# EAGLE design leds-2 (EAGLE 7.7.0)
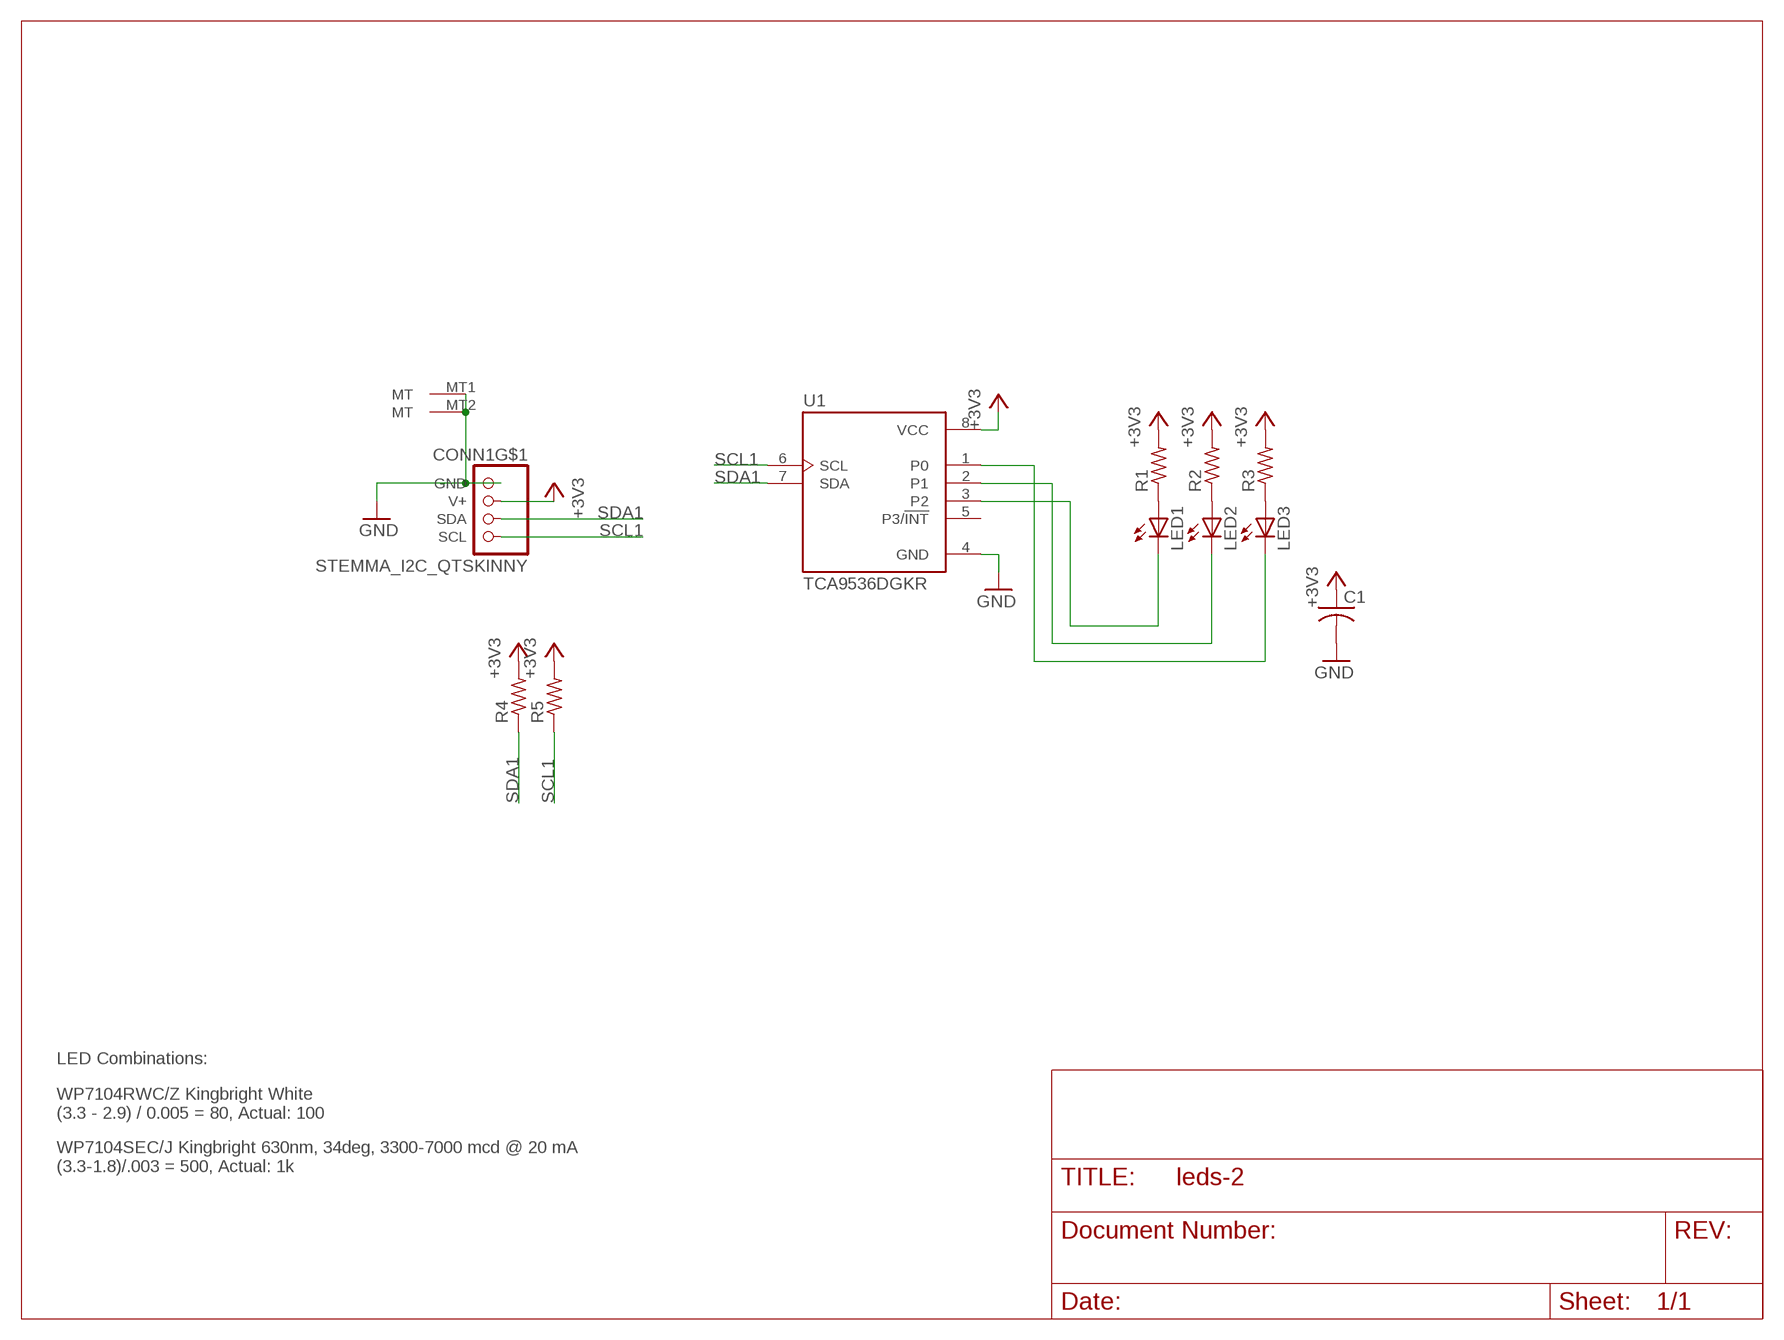
[diagram p0: schematic, sheet 1]

## Parts
C1  C-USC0603K  [C0603K]
CONN1  STEMMA_I2C_QTSKINNY  [JST_SH4_SKINNY]
LED1  LED3MM  [LED3MM]
LED2  LED3MM  [LED3MM]
LED3  LED3MM  [LED3MM]
R1  R-US_R0603  [R0603]
R2  R-US_R0603  [R0603]
R3  R-US_R0603  [R0603]
R4  R-US_R0603  [R0603]
R5  R-US_R0603  [R0603]
U1  TCA9536DGKR  [SOP65P490X110-8N]

## Nets
+3V3: C1.1 CONN1.2(V+) R1.2 R2.2 R3.2 R4.2 R5.2 U1.8(VCC)
GND [power]: C1.2 CONN1.1(GND) CONN1.MT1(MT) CONN1.MT2(MT) U1.4(GND)
N$1: LED3.K(C) U1.1(P0)
N$2: LED2.K(C) U1.2(P1)
N$3: LED1.K(C) U1.3(P2)
N$4: LED1.A R1.1
N$5: LED2.A R2.1
N$6: LED3.A R3.1
SCL1: CONN1.4(SCL) R5.1 U1.6(SCL)
SDA1: CONN1.3(SDA) R4.1 U1.7(SDA)
Unconnected: U1.5(P3/!INT)

## Notes on the sheet
- LED Combinations:
- WP7104RWC/Z Kingbright White
  (3.3 - 2.9) / 0.005 = 80, Actual: 100
- WP7104SEC/J Kingbright 630nm, 34deg, 3300-7000 mcd @ 20 mA
  (3.3-1.8)/.003 = 500, Actual: 1k

## Library data of the parts
C1 = rcl:C-US: CAPACITOR, American symbol
CONN1 = microbuilder:STEMMA_I2C
LED1-LED3 = led:LED: LED OSRAM: - CHIPLED LG R971, LG N971, LY N971, LG Q971, LY Q971, LO R971, LY R971 LH N974, LH R974 LS Q976, LO Q976, LY Q976 LO Q996 - Hyper CHIPLED LW Q18S LB Q993, LB Q99A, LB R99A - SideLED LS A670, LO A670, LY A670, LG A670, LP A670 LB A673, LV A673, LT A673, LW A673 LH A674 LY A675 LS A676, LA A676, LO A676, LY A676, LW A676 LS A679, LY A679, LG A679 - Hyper Micro SIDELED® LS Y876, LA Y876, LO Y876, LY Y876 LT Y87S - SmartLED LW L88C, LW L88S LB L89C, LB L89S, LG L890 LS L89K, LO L89K, LY L89K LS L896, LA L896, LO L896, LY L896 - TOPLED LS T670, LO T670, LY T670, LG T670, LP T670 LSG T670, LSP T670, LSY T670, LOP T670, LYG T670 LG T671, LOG T671, LSG T671 LB T673, LV T673, LT T673, LW T673 LH T674 LS T676, LA T676, LO T676, LY T676, LB T676, LH T676, LSB T676, LW T676 LB T67C, LV T67C, LT T67C, LS T67K, LO T67K, LY T67K, LW E67C LS E67B, LA E67B, LO E67B, LY E67B, LB E67C, LV E67C, LT E67C LW T67C LS T679, LY T679, LG T679 LS T770, LO T770, LY T770, LG T770, LP T770 LB T773, LV T773, LT T773, LW T773 LH T774 LS E675, LA E675, LY E675, LS T675 LS T776, LA T776, LO T776, LY T776, LB T776 LHGB T686 LT T68C, LB T68C - Hyper Mini TOPLED® LB M676 - Mini TOPLED Santana® LG M470 LS M47K, LO M47K, LY M47K Source: http://www.osram.convergy.de LUXEON: - LUMILED® LXK2-PW12-R00, LXK2-PW12-S00, LXK2-PW14-U00, LXK2-PW14-V00 LXK2-PM12-R00, LXK2-PM12-S00, LXK2-PM14-U00 LXK2-PE12-Q00, LXK2-PE12-R00, LXK2-PE12-S00, LXK2-PE14-T00, LXK2-PE14-U00 LXK2-PB12-K00, LXK2-PB12-L00, LXK2-PB12-M00, LXK2-PB14-N00, LXK2-PB14-P00, LXK2-PB14-Q00 LXK2-PR12-L00, LXK2-PR12-M00, LXK2-PR14-Q00, LXK2-PR14-R00 LXK2-PD12-Q00, LXK2-PD12-R00, LXK2-PD12-S00 LXK2-PH12-R00, LXK2-PH12-S00 LXK2-PL12-P00, LXK2-PL12-Q00, LXK2-PL12-R00 Source: www.luxeon.com KINGBRIGHT: KA-3528ASYC Source: www.kingbright.com
R1-R5 = rcl:R-US_: RESISTOR, American symbol
U1 = TCA9536DGKR:TCA9536DGKR; MANUFACTURER: Texas Instruments; MAXIMUM_PACKAGE_HEIGHT: 1.1 mm; PARTREV: A; STANDARD: IPC 7351B

## Net classes
1 power: width 0.305 mm

## Board
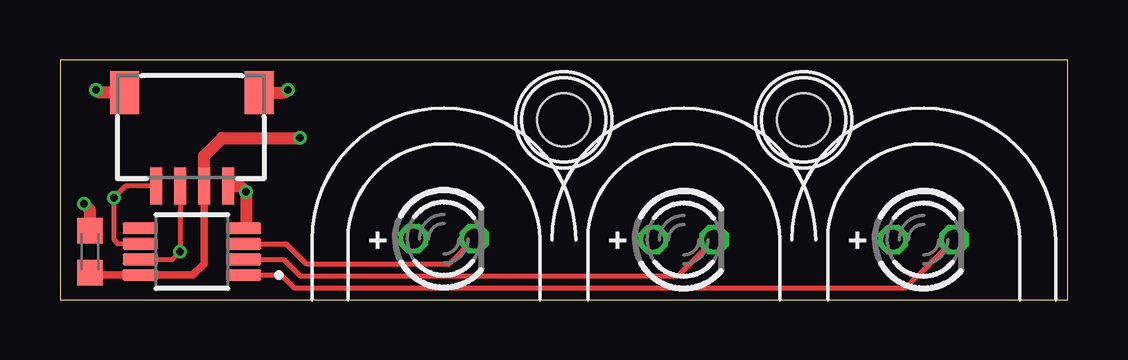
[diagram p1: board, top side]
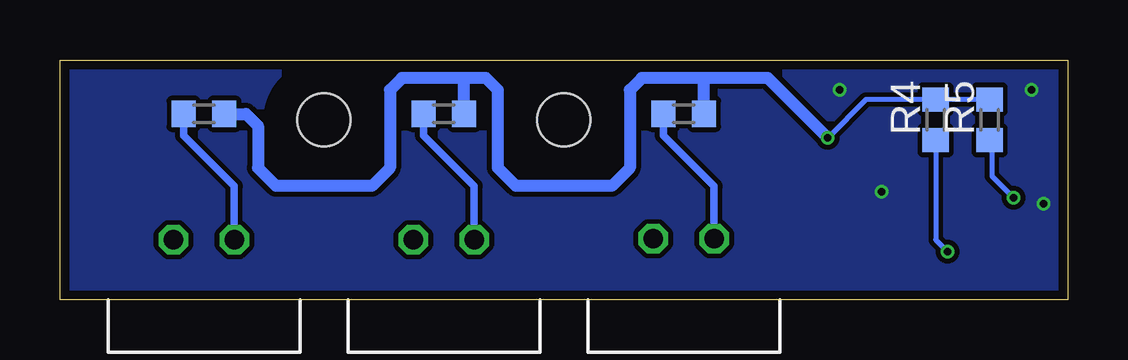
[diagram p2: board, bottom side, seen from below]

Size 42 x 10 mm. Coordinates in mm from the lower left corner, seen from the top.
Outline: 0,0 42,0 42,10 0,10 0,0
Copper layers (1*16): Top 0.035559375mm / dielectric 1.6mm / Bottom 0.035559375mm
Design rules "oshpark-2layer-2018": minimum track width 6mil, minimum drill 10mil, track to track 6mil, track to pad 6mil, pad to pad 6mil, via to via 6mil, smd to smd 6mil, copper to edge 15mil, drill to drill 6mil, minimum pad ring 5mil, minimum via ring 5mil, stop-mask expansion 2.5mil, vias tented up to drill 0mil, thermal gap 10mil
Holes 2.2 mm at 21,7.5 31,7.5
bRestrict: area 18.7,5.2 to 23.3,9.8; area 28.7,5.2 to 33.3,9.8

### Footprints (pad centres in the part's own frame; a part is rotated, then mirrored left to right if it is on the bottom)
C0603K = smd 1.05 x 1.08: 1 -0.875,0; 2 0.875,0
JST_SH4_SKINNY = smd 0.5 x 1.55: 1 -1.5,2.514; 2 -0.5,2.514; 3 0.5,2.514; 4 1.5,2.514 | smd 1.2 x 1.8: MT1 -2.8,-1.386; MT2 2.8,-1.386
LED3MM = drill 0.813 octagon: A -1.27,0; K 1.27,0
R0603 = smd 1 x 1.1: 1 -0.85,0; 2 0.85,0
SOP65P490X110-8N = smd 1.47 x 0.48: 1 -2.15,0.975; 2 -2.15,0.325; 3 -2.15,-0.325; 4 -2.15,-0.975; 5 2.15,-0.975; 6 2.15,-0.325; 7 2.15,0.325; 8 2.15,0.975

### Placement (x,y rotation side)
C1  1.25,2 90 top
CONN1  5.5,7.25 180 top
LED1  16,2.54 0 top
LED2  26,2.5 0 top
LED3  36,2.5 0 top
R1  16,7.75 0 bottom
R2  26,7.75 0 bottom
R3  36,7.75 0 bottom
R4  5.5,7.5 90 bottom
R5  3.25,7.5 90 bottom
U1  5.5,2 180 top

### Tracks (layer width: path | path; a pad name or v marks a point on that pad's centre or on a via)
+3V3  (via drill 0.3)
  Top 0.203: 1.25,1.02 C1.1
  Top 0.305: 1.25,1.02 U1.8 5.53,1.02 6,1.5 CONN1.2
  Top 0.508: CONN1.2 6,6 6.75,6.75 v10,6.75
  Bottom 0.203: 25.15,9.15 25.25,9.25 | 15.15,9.15 15.25,9.25 | R5.2 R4.2 8.4,8.35 v10,6.75
  Bottom 0.508: v10,6.75 12.5,9.25 15.25,9.25 17.75,9.25 18.25,8.75 18.25,5.5 19,4.75 23,4.75 23.75,5.5 23.75,8.75 24.25,9.25 25.25,9.25 27.75,9.25 28.25,8.75 28.25,5.5 29,4.75 33,4.75 33.75,5.5 33.75,7.25 34.25,7.75 R3.2 | R2.2 25.15,9.15 | R1.2 15.15,9.15
GND  (via drill 0.3)
  Top 0.508: C1.2 1.25,3.75 v1,4 | CONN1.MT2 1.61,8.64 v1.5,8.75 | CONN1.MT1 9.39,8.64 v9.5,8.75 | CONN1.1 7.51,4.74 v7.75,4.5 7.75,3.08 U1.4
  pour Bottom (isolate 0.203): 0,0 42,0 42,10 0,10
N$1
  Top 0.203: U1.1 9.22,1.02 9.75,0.5 35.25,0.5 35.77,1.02 35.8,1.02 LED3.K
N$2
  Top 0.203: U1.2 9.32,1.68 10,1 25.77,1 LED2.K
N$3
  Top 0.203: U1.3 9.43,2.33 10.25,1.5 16.23,1.5 LED1.K
N$4
  Bottom 0.305: LED1.A 14.73,4.73 16.85,6.85 R1.1
N$5
  Bottom 0.305: LED2.A 24.73,4.73 26.85,6.85 R2.1
N$6
  Bottom 0.305: LED3.A 34.73,4.73 36.85,6.85 R3.1
SCL1  (via drill 0.3)
  Top 0.203: U1.6 2.42,2.33 2.25,2.5 v2.25,4.25 2.74,4.74 CONN1.4
  Bottom 0.203: R5.1 3.15,6.65 3.15,5.15 v2.25,4.25
SDA1  (via drill 0.3)
  Top 0.203: U1.7 4.67,1.68 v5,2 CONN1.3
  Bottom 0.203: R4.1 5.5,2.5 v5,2

### Text on the board
_tsilk: + | + | +